# EAGLE schematic Laikata (EAGLE 9.6.2)
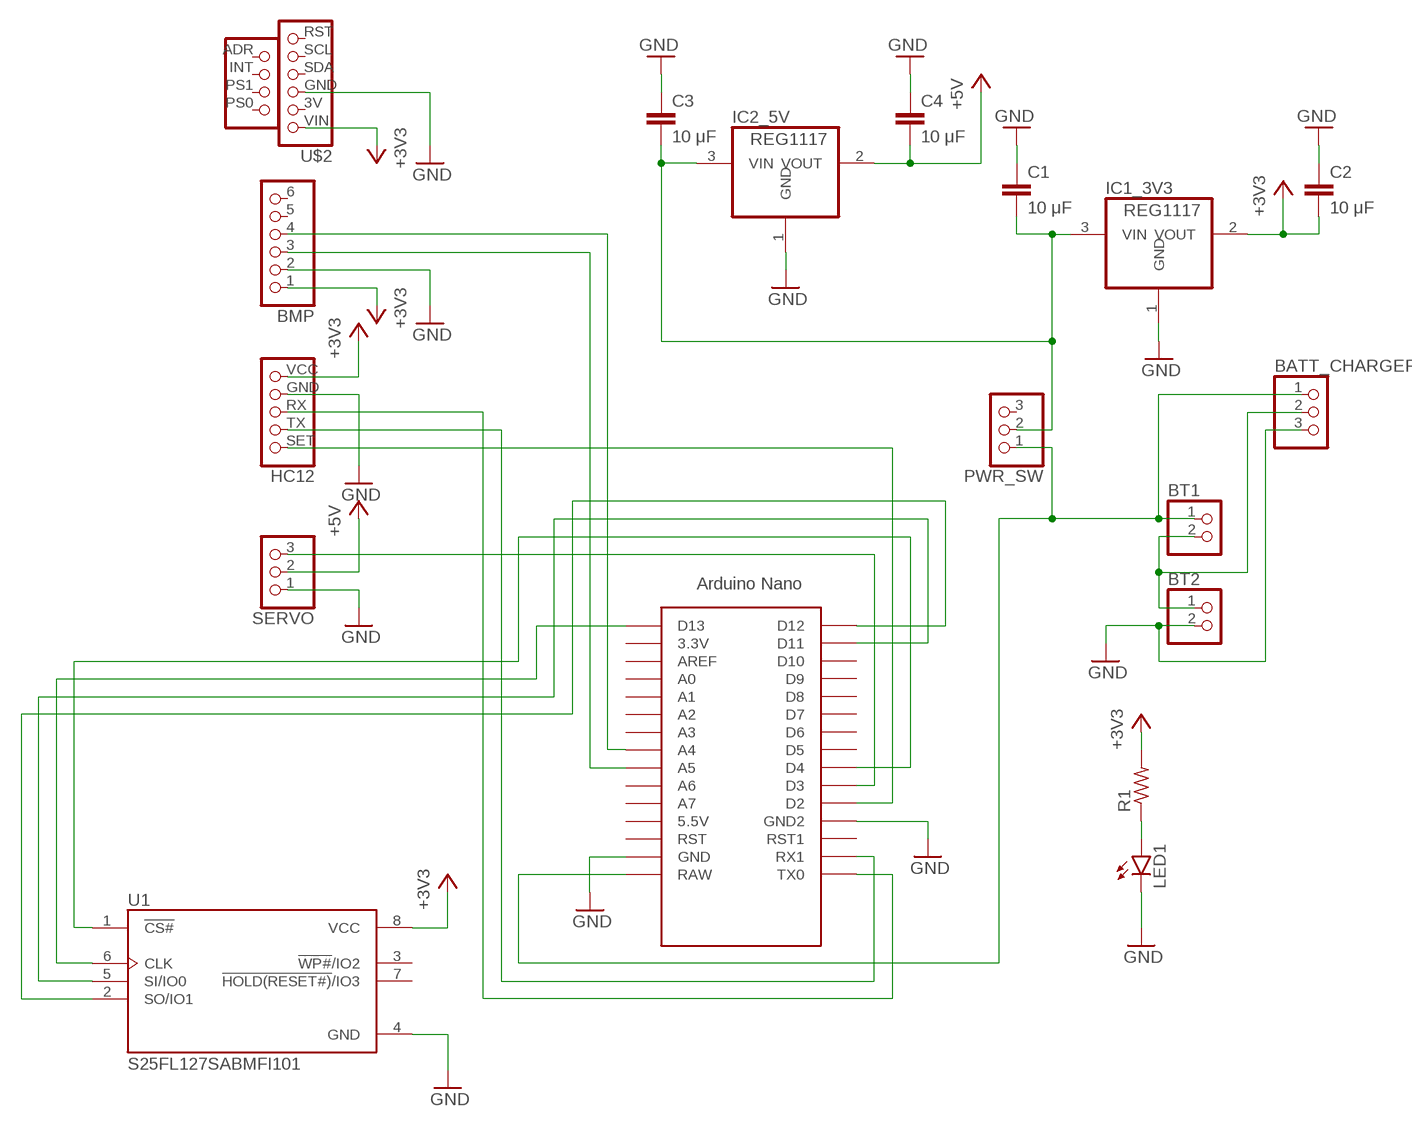
[diagram p0: schematic, sheet 1]

## Parts
BATT_CHARGER  PINHD-1X3  [1X03]
BMP  PINHD-1X6  [1X06]
BT1  PINHD-1X2  [1X02]
BT2  PINHD-1X2  [1X02]
C1  10 μF  C-EUC1210  [C1210]
C2  10 μF  C-EUC1210  [C1210]
C3  10 μF  C-EUC1210  [C1210]
C4  10 μF  C-EUC1210  [C1210]
HC12  HC12  [HC12]
IC1_3V3  REG1117  [SOT223]
IC2_5V  REG1117  [SOT223]
LED1  LED3MM  [LED3MM]
PWR_SW  PINHD-1X3  [1X03]
R1  R-US_R1206  [R1206]
SERVO  PINHD-1X3  [1X03]
U1  S25FL127SABMFI101  [SOIC127P800X216-8N]
U$1  NANO  [NANO]
U$2  IMU  [IMU]

## Nets
+3V3: BMP.1 C2.2 HC12.VCC IC1_3V3.2(VOUT) R1.2 U1.8(VCC) U$2.VIN
+5V: C4.2 IC2_5V.2(VOUT) SERVO.2
GND: BATT_CHARGER.3 BMP.2 BT2.2 C1.1 C2.1 C3.1 C4.1 HC12.GND IC1_3V3.1(GND) IC2_5V.1(GND) LED1.K(C) SERVO.1 U1.4(GND) U$1.GND U$1.GND1(GND2) U$2.GND
N$1: BATT_CHARGER.1 BT1.1 PWR_SW.1 U$1.RAW
N$2: C1.2 C3.2 IC1_3V3.3(VIN) IC2_5V.3(VIN) PWR_SW.2
N$3: HC12.SET U$1.D2
N$4: HC12.TX U$1.RX1
N$5: HC12.RX U$1.TX0
N$7: SERVO.3 U$1.D3
N$8: LED1.A R1.1
N$9: U1.1(!CS#) U$1.D4
N$13: U1.6(CLK) U$1.D13
N$14: U1.5(SI/IO0) U$1.D11
N$15: U1.2(SO/IO1) U$1.D12
N$16: BMP.3 U$1.A5
N$17: BMP.4 U$1.A4
N$18: BATT_CHARGER.2 BT1.2 BT2.1
Unconnected: BMP.5 BMP.6 PWR_SW.3 U1.3(!WP#!/IO2) U1.7(!HOLD(RESET#)!/IO3) U$1.3.3V U$1.5V(5.5V) U$1.A0 U$1.A1 U$1.A2 U$1.A3 U$1.A6 U$1.A7 U$1.AREF U$1.D5 U$1.D6 U$1.D7 U$1.D8 U$1.D9 U$1.D10 U$1.RST U$1.RST1 U$2.3V U$2.ADR U$2.INT U$2.PS0 U$2.PS1 U$2.RST U$2.SCL U$2.SDA

## Library data of the parts
BATT_CHARGER PWR_SW SERVO = pinhead:PINHD-1X3: PIN HEADER
BMP = pinhead:PINHD-1X6: PIN HEADER
BT1 BT2 = pinhead:PINHD-1X2: PIN HEADER
C1-C4 = rcl:C-EU: CAPACITOR, European symbol; SPICEPREFIX: C
HC12 = hc12:HC12: PIN HEADER
IC1_3V3 IC2_5V = burr-brown:REG1117: 800mA and 1A Low Dropout (LDO) Positive Regulator 1.8V, 2.5V, 2.85V, 3.3V, 5V, and Adj; MPN: REG1117; OC_FARNELL: 1097566; OC_NEWARK: 14P6981
LED1 = led:LED: LED OSRAM: - CHIPLED LG R971, LG N971, LY N971, LG Q971, LY Q971, LO R971, LY R971 LH N974, LH R974 LS Q976, LO Q976, LY Q976 LO Q996 - Hyper CHIPLED LW Q18S LB Q993, LB Q99A, LB R99A - SideLED LS A670, LO A670, LY A670, LG A670, LP A670 LB A673, LV A673, LT A673, LW A673 LH A674 LY A675 LS A676, LA A676, LO A676, LY A676, LW A676 LS A679, LY A679, LG A679 - Hyper Micro SIDELED® LS Y876, LA Y876, LO Y876, LY Y876 LT Y87S - SmartLED LW L88C, LW L88S LB L89C, LB L89S, LG L890 LS L89K, LO L89K, LY L89K LS L896, LA L896, LO L896, LY L896 - TOPLED LS T670, LO T670, LY T670, LG T670, LP T670 LSG T670, LSP T670, LSY T670, LOP T670, LYG T670 LG T671, LOG T671, LSG T671 LB T673, LV T673, LT T673, LW T673 LH T674 LS T676, LA T676, LO T676, LY T676, LB T676, LH T676, LSB T676, LW T676 LB T67C, LV T67C, LT T67C, LS T67K, LO T67K, LY T67K, LW E67C LS E67B, LA E67B, LO E67B, LY E67B, LB E67C, LV E67C, LT E67C LW T67C LS T679, LY T679, LG T679 LS T770, LO T770, LY T770, LG T770, LP T770 LB T773, LV T773, LT T773, LW T773 LH T774 LS E675, LA E675, LY E675, LS T675 LS T776, LA T776, LO T776, LY T776, LB T776 LHGB T686 LT T68C, LB T68C - Hyper Mini TOPLED® LB M676 - Mini TOPLED Santana® LG M470 LS M47K, LO M47K, LY M47K Source: http://www.osram.convergy.de LUXEON: - LUMILED® LXK2-PW12-R00, LXK2-PW12-S00, LXK2-PW14-U00, LXK2-PW14-V00 LXK2-PM12-R00, LXK2-PM12-S00, LXK2-PM14-U00 LXK2-PE12-Q00, LXK2-PE12-R00, LXK2-PE12-S00, LXK2-PE14-T00, LXK2-PE14-U00 LXK2-PB12-K00, LXK2-PB12-L00, LXK2-PB12-M00, LXK2-PB14-N00, LXK2-PB14-P00, LXK2-PB14-Q00 LXK2-PR12-L00, LXK2-PR12-M00, LXK2-PR14-Q00, LXK2-PR14-R00 LXK2-PD12-Q00, LXK2-PD12-R00, LXK2-PD12-S00 LXK2-PH12-R00, LXK2-PH12-S00 LXK2-PL12-P00, LXK2-PL12-Q00, LXK2-PL12-R00 Source: www.luxeon.com KINGBRIGHT: KA-3528ASYC Source: www.kingbright.com
R1 = rcl:R-US_: RESISTOR, American symbol; SPICEPREFIX: R
U1 = S25FL127SABMFI101:S25FL127SABMFI101: S25FL127S Series 128 Mb (16M x 8) 3 V SMT SPI Serial Flash-NOR Memory - SOIC-8 Check availability <https://pricing.snapeda.com/parts/S25FL127SABMFI101/Cypress%20Semiconductor/view-part?ref=eda>; AVAILABILITY: In Stock; DESCRIPTION: FLASH - NOR Memory IC 128Mb (16M x 8) SPI - Quad I/O 108 MHz 8-SOIC; MF: Cypress Semiconductor; MP: S25FL127SABMFI101; PACKAGE: SOIC-8 Spansion; PRICE: None
U$1 = Arduino-clone:NANO: Arduino Nano
U$2 = hc12:IMU